# EAGLE design usb-pd (EAGLE 7.7.0)
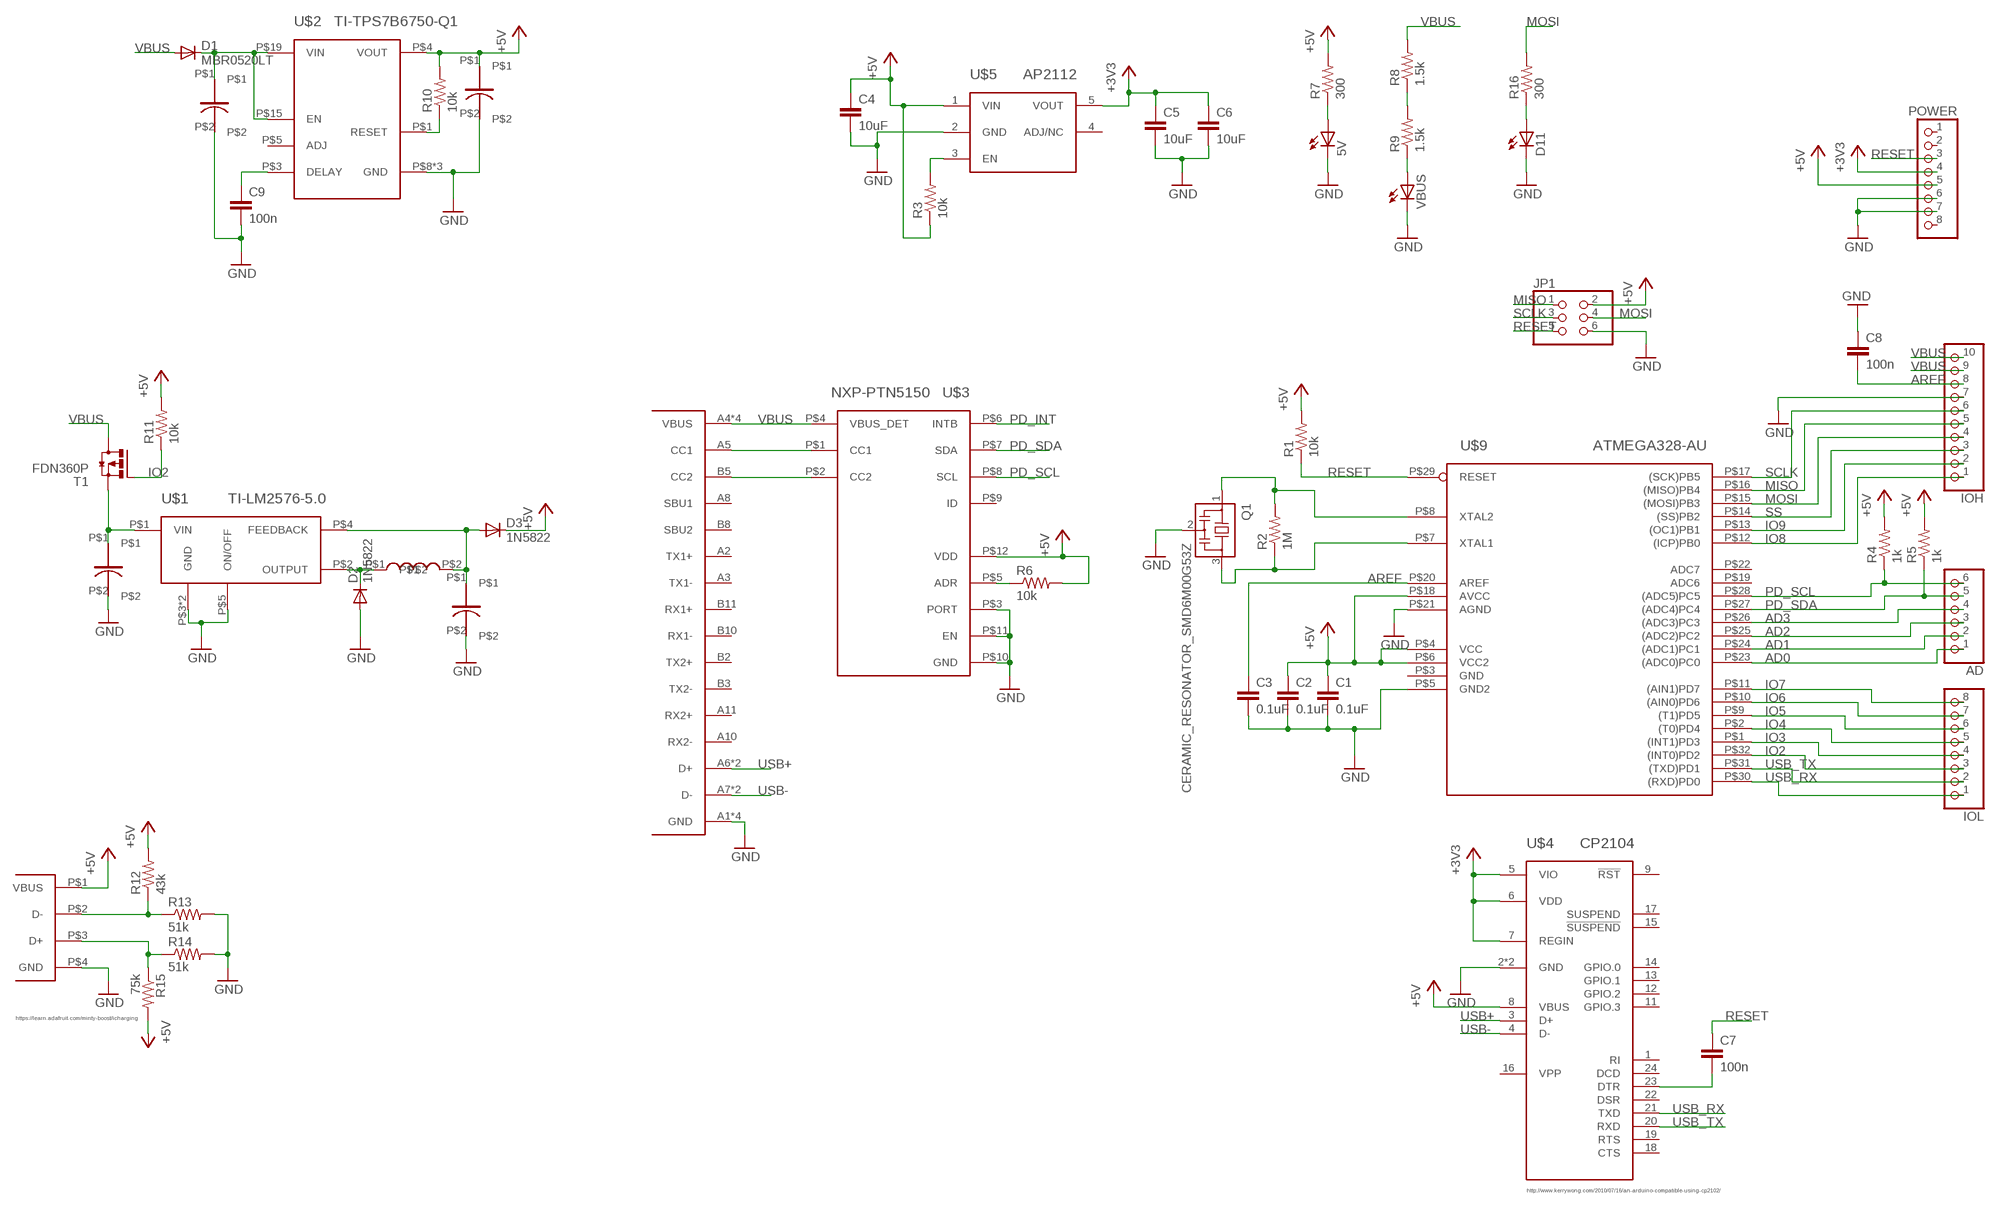
[diagram p0: schematic, sheet 1]

## Parts
5V  LEDCHIPLED_0603  [CHIPLED_0603]
AD  PINHD-1X6  [1X06]
C1  0.1uF  C-EUC0402  [C0402]
C2  0.1uF  C-EUC0402  [C0402]
C3  0.1uF  C-EUC0402  [C0402]
C4  10uF  C-EUC0805  [C0805]
C5  10uF  C-EUC0805  [C0805]
C6  10uF  C-EUC0805  [C0805]
C7  100n  C-EUC0402  [C0402]
C8  100n  C-EUC0402  [C0402]
C9  100n  C-EUC0603  [C0603]
C10  UWT1V101MCL1GS  [UWT1V101MCL1GS]
C11  AVE108M10G24T-F  [AVE108M10G]
C12  WURTH-865080543009-47uF  WURTH-865080543009  [WURTH-865090543005]
C13  WURTH-865090543005-22uF  WURTH-865090543005  [WURTH-865090543005]
D1  MBR0520LT  [SOD123]
D2  1N5822  1N5400  [DO201-15]
D3  1N5822  1N5400  [DO201-15]
D11  LEDCHIPLED_0603  [CHIPLED_0603]
IOH  PINHD-1X10  [1X10]
IOL  PINHD-1X8  [1X08]
J$1  TYPE-C-12401548E4  [AMPHENOL-TYPE-C-12401548E4]
J$2  UE27AC54100  [UE27AC54100]
JP1  PINHD-2X3  [2X03]
POWER  PINHD-1X8  [1X08]
Q1  CERAMIC_RESONATOR_SMD6M00G53Z  [CERAMIC_RESONATOR_SMD]
R1  10k  R-US_R0402  [R0402]
R2  1M  R-US_R0402  [R0402]
R3  10k  R-US_R0402  [R0402]
R4  1k  R-US_R0402  [R0402]
R5  1k  R-US_R0402  [R0402]
R6  10k  R-US_R0402  [R0402]
R7  300  R-US_R0402  [R0402]
R8  1.5k  R-US_R0402  [R0402]
R9  1.5k  R-US_R0402  [R0402]
R10  10k  R-US_R0805  [R0805]
R11  10k  R-US_R0402  [R0402]
R12  43k  R-US_R0402  [R0402]
R13  51k  R-US_R0402  [R0402]
R14  51k  R-US_R0402  [R0402]
R15  75k  R-US_R0402  [R0402]
R16  300  R-US_R0402  [R0402]
T1  FDN360P  [SUPER-SOT3]
U$1  TI-LM2576-5.0  [TO-263]
U$2  TI-TPS7B6750-Q1  [HTSSOP-20]
U$3  NXP-PTN5150  [X2QFN12]
U$4  CP2104  [QFN24_4X4]
U$5  AP2112  [SOT23-5L]
U$7  WEURTH-784771101  [1260]
U$9  ATMEGA328-AU  [32-TQFP]
VBUS  LEDCHIPLED_0603  [CHIPLED_0603]

## Nets
+3V3: C5.1 C6.1 POWER.4 U$4.5(VIO) U$4.6(VDD) U$4.7(REGIN) U$5.5(VOUT)
+5V: C1.1 C2.1 C4.1 C13.P$1 D3.C J$2.P$1(VBUS) JP1.2 POWER.5 R1.2 R3.1 R4.2 R5.2 R6.2 R7.2 R10.2 R11.2 R12.2 R15.2 U$2.P$4(VOUT) U$3.P$12(VDD) U$4.8(VBUS) U$5.1(VIN) U$9.P$4(VCC) U$9.P$6(VCC2) U$9.P$18(AVCC)
AD0: AD.1 U$9.P$23((ADC0)PC0)
AD1: AD.2 U$9.P$24((ADC1)PC1)
AD2: AD.3 U$9.P$25((ADC2)PC2)
AD3: AD.4 U$9.P$26((ADC3)PC3)
AREF: C3.1 C8.2 IOH.8 U$9.P$20(AREF)
GND: 5V.C C1.2 C2.2 C3.2 C4.2 C5.2 C6.2 C8.1 C9.2 C10.P$2 C11.P$2 C12.P$2 C13.P$2 D2.A D11.C IOH.7 J$1.A1(GND) J$1.A12(GND) J$1.B1(GND) J$1.B12(GND) J$2.P$4(GND) JP1.6 POWER.6 POWER.7 Q1.2 R13.2 R14.2 U$1.P$3(GND) U$1.P$5(ON/OFF) U$1.P$6(GND) U$2.P$8(GND) U$2.P$13(GND) U$2.P$21(GND) U$3.P$3(PORT) U$3.P$10(GND) U$3.P$11(EN) U$4.2(GND) U$4.25(GND) U$5.2(GND) U$9.P$5(GND2) U$9.P$21(AGND) VBUS.C
IO2: IOL.3 R11.1 T1.1(G) U$9.P$32((INT0)PD2)
IO3: IOL.4 U$9.P$1((INT1)PD3)
IO4: IOL.5 U$9.P$2((T0)PD4)
IO5: IOL.6 U$9.P$9((T1)PD5)
IO6: IOL.7 U$9.P$10((AIN0)PD6)
IO7: IOL.8 U$9.P$11((AIN1)PD7)
IO8: IOH.1 U$9.P$12((ICP)PB0)
IO9: IOH.2 U$9.P$13((OC1)PB1)
MISO: IOH.5 JP1.1 U$9.P$16((MISO)PB4)
MOSI: IOH.4 JP1.4 R16.2 U$9.P$15((MOSI)PB3)
N$1: C10.P$1 T1.2(S) U$1.P$1(VIN)
N$2: Q1.3 R2.1 U$9.P$7(XTAL1)
N$3: Q1.1 R2.2 U$9.P$8(XTAL2)
N$4: C7.2 U$4.23(DTR)
N$5: J$1.A5(CC1) U$3.P$1(CC1)
N$6: J$1.B5(CC2) U$3.P$2(CC2)
N$7: R3.2 U$5.3(EN)
N$8: R6.1 U$3.P$5(ADR)
N$9: D2.C U$1.P$2(OUTPUT) U$7.P$1
N$10: 5V.A R7.1
N$11: R9.1 VBUS.A
N$12: R8.1 R9.2
N$13: R10.1 U$2.P$1(RESET)
N$14: C9.1 U$2.P$3(DELAY)
N$15: C11.P$1 D3.A U$1.P$4(FEEDBACK) U$7.P$2
N$16: D11.A R16.1
N$17: J$2.P$2(D-) R12.1 R13.1
N$18: J$2.P$3(D+) R14.1 R15.1
N$40: C12.P$1 D1.C U$2.P$15(EN) U$2.P$19(VIN)
PD_INT: U$3.P$6(INTB)
PD_SCL: AD.6 R4.1 U$3.P$8(SCL) U$9.P$28((ADC5)PC5)
PD_SDA: AD.5 R5.1 U$3.P$7(SDA) U$9.P$27((ADC4)PC4)
RESET: C7.1 JP1.5 POWER.3 R1.1 U$9.P$29(RESET)
SCLK: IOH.6 JP1.3 U$9.P$17((SCK)PB5)
SS: IOH.3 U$9.P$14((SS)PB2)
USB+: J$1.A6(D+) J$1.B6(D+) U$4.3(D+)
USB-: J$1.A7(D-) J$1.B7(D-) U$4.4(D-)
USB_RX: IOL.1 U$4.21(TXD) U$9.P$30((RXD)PD0)
USB_TX: IOL.2 U$4.20(RXD) U$9.P$31((TXD)PD1)
VBUS: D1.A IOH.9 IOH.10 J$1.A4(VBUS) J$1.A9(VBUS) J$1.B4(VBUS) J$1.B9(VBUS) R8.2 T1.3(D) U$3.P$4(VBUS_DET)
Unconnected: J$1.A2(TX1+) J$1.A3(TX1-) J$1.A8(SBU1) J$1.A10(RX2-) J$1.A11(RX2+) J$1.B2(TX2+) J$1.B3(TX2-) J$1.B8(SBU2) J$1.B10(RX1-) J$1.B11(RX1+) POWER.1 POWER.2 POWER.8 U$2.P$5(ADJ) U$3.P$9(ID) U$4.1(RI) U$4.9(!RST) U$4.11(GPIO.3) U$4.12(GPIO.2) U$4.13(GPIO.1) U$4.14(GPIO.0) U$4.15(!SUSPEND) U$4.16(VPP) U$4.17(SUSPEND) U$4.18(CTS) U$4.19(RTS) U$4.22(DSR) U$4.24(DCD) U$5.4(ADJ/NC) U$9.P$3(GND) U$9.P$19(ADC6) U$9.P$22(ADC7)

## Notes on the sheet
- https://learn.adafruit.com/minty-boost/icharging
- http://www.kerrywong.com/2010/07/16/an-arduino-compatible-using-cp2102/

## Library data of the parts
5V D11 VBUS = led:LED: LED OSRAM: - CHIPLED LG R971, LG N971, LY N971, LG Q971, LY Q971, LO R971, LY R971 LH N974, LH R974 LS Q976, LO Q976, LY Q976 LO Q996 - Hyper CHIPLED LW Q18S LB Q993, LB Q99A, LB R99A - SideLED LS A670, LO A670, LY A670, LG A670, LP A670 LB A673, LV A673, LT A673, LW A673 LH A674 LY A675 LS A676, LA A676, LO A676, LY A676, LW A676 LS A679, LY A679, LG A679 - Hyper Micro SIDELED® LS Y876, LA Y876, LO Y876, LY Y876 LT Y87S - SmartLED LW L88C, LW L88S LB L89C, LB L89S, LG L890 LS L89K, LO L89K, LY L89K LS L896, LA L896, LO L896, LY L896 - TOPLED LS T670, LO T670, LY T670, LG T670, LP T670 LSG T670, LSP T670, LSY T670, LOP T670, LYG T670 LG T671, LOG T671, LSG T671 LB T673, LV T673, LT T673, LW T673 LH T674 LS T676, LA T676, LO T676, LY T676, LB T676, LH T676, LSB T676, LW T676 LB T67C, LV T67C, LT T67C, LS T67K, LO T67K, LY T67K, LW E67C LS E67B, LA E67B, LO E67B, LY E67B, LB E67C, LV E67C, LT E67C LW T67C LS T679, LY T679, LG T679 LS T770, LO T770, LY T770, LG T770, LP T770 LB T773, LV T773, LT T773, LW T773 LH T774 LS E675, LA E675, LY E675, LS T675 LS T776, LA T776, LO T776, LY T776, LB T776 LHGB T686 LT T68C, LB T68C - Hyper Mini TOPLED® LB M676 - Mini TOPLED Santana® LG M470 LS M47K, LO M47K, LY M47K Source: http://www.osram.convergy.de LUXEON: - LUMILED® LXK2-PW12-R00, LXK2-PW12-S00, LXK2-PW14-U00, LXK2-PW14-V00 LXK2-PM12-R00, LXK2-PM12-S00, LXK2-PM14-U00 LXK2-PE12-Q00, LXK2-PE12-R00, LXK2-PE12-S00, LXK2-PE14-T00, LXK2-PE14-U00 LXK2-PB12-K00, LXK2-PB12-L00, LXK2-PB12-M00, LXK2-PB14-N00, LXK2-PB14-P00, LXK2-PB14-Q00 LXK2-PR12-L00, LXK2-PR12-M00, LXK2-PR14-Q00, LXK2-PR14-R00 LXK2-PD12-Q00, LXK2-PD12-R00, LXK2-PD12-S00 LXK2-PH12-R00, LXK2-PH12-S00 LXK2-PL12-P00, LXK2-PL12-Q00, LXK2-PL12-R00 Source: www.luxeon.com KINGBRIGHT: KA-3528ASYC Source: www.kingbright.com
AD = pinhead:PINHD-1X6: PIN HEADER
C1-C9 = rcl:C-EU: CAPACITOR, European symbol
C10 = usb-pd:UWT1V101MCL1GS
C11 = usb-pd:AVE108M10G24T-F
C12 = usb-pd:WURTH-865080543009
C13 = usb-pd:WURTH-865090543005
D1 = diode:MBR0520LT: SCHOTTKY BARRIER RECTIFIER Source: http://onsemi.com .. MBR0520LT1-D.pdf
D2 D3 = diode:1N5400: DIODE standard rectifier, 3 A, 50 V (Motorola)
IOH = pinhead:PINHD-1X10: PIN HEADER
IOL POWER = pinhead:PINHD-1X8: PIN HEADER
J$1 = usb-pd:TYPE-C-12401548E4
J$2 = usb-pd:UE27AC54100
JP1 = pinhead:PINHD-2X3: PIN HEADER
Q1 = usb-pd:CERAMIC_RESONATOR_SMD: Resonator Source: murata.co.jp; MPN: CSTCR6M00G53-R0; OC_FARNELL: 1170434; OC_NEWARK: 25M8759
R1-R16 = rcl:R-US_: RESISTOR, American symbol
T1 = transistor-power:FDN360P: Single P-Channel, PowerTrench (R) MOSFET Source: http://www.fairchildsemi.com/ds/FD/FDN360P.pdf
U$1 = usb-pd:TI-LM2576-5.0
U$2 = usb-pd:TI-TPS7B6750-Q1
U$3 = usb-pd:NXP-PTN5150
U$4 = usb-pd:CP2104
U$5 = usb-pd:AP2112
U$7 = usb-pd:WEURTH-784771101
U$9 = usb-pd:ATMEGA328-AU; DIGIKEY: ATMEGA328-AU-ND

## Board
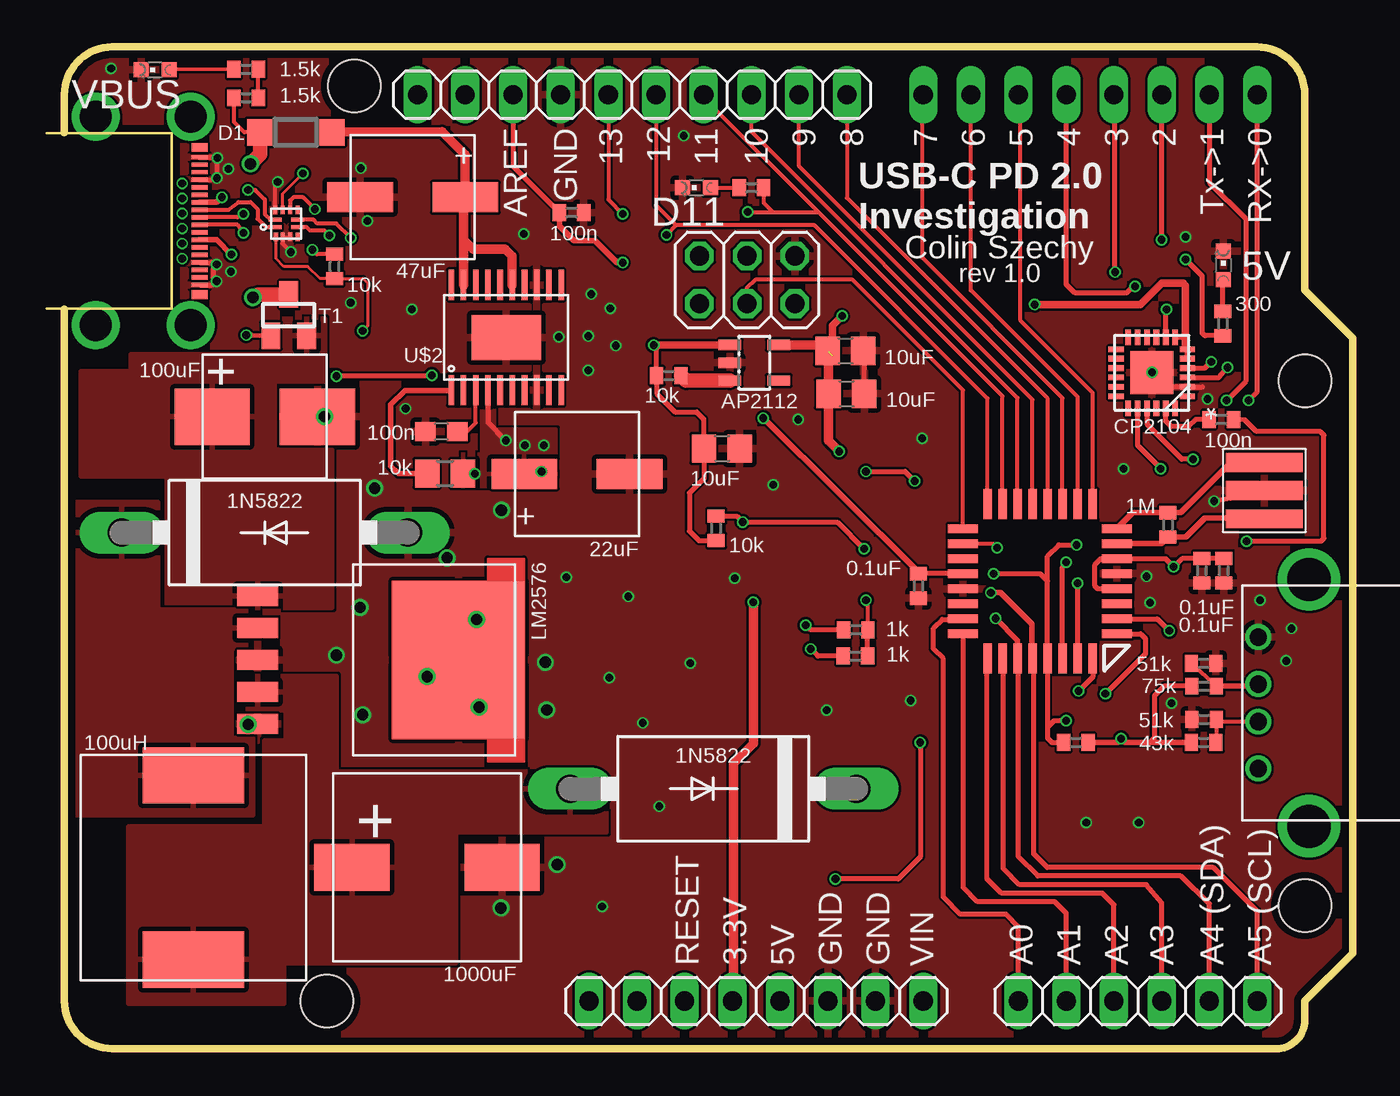
[diagram p1: board, top side]
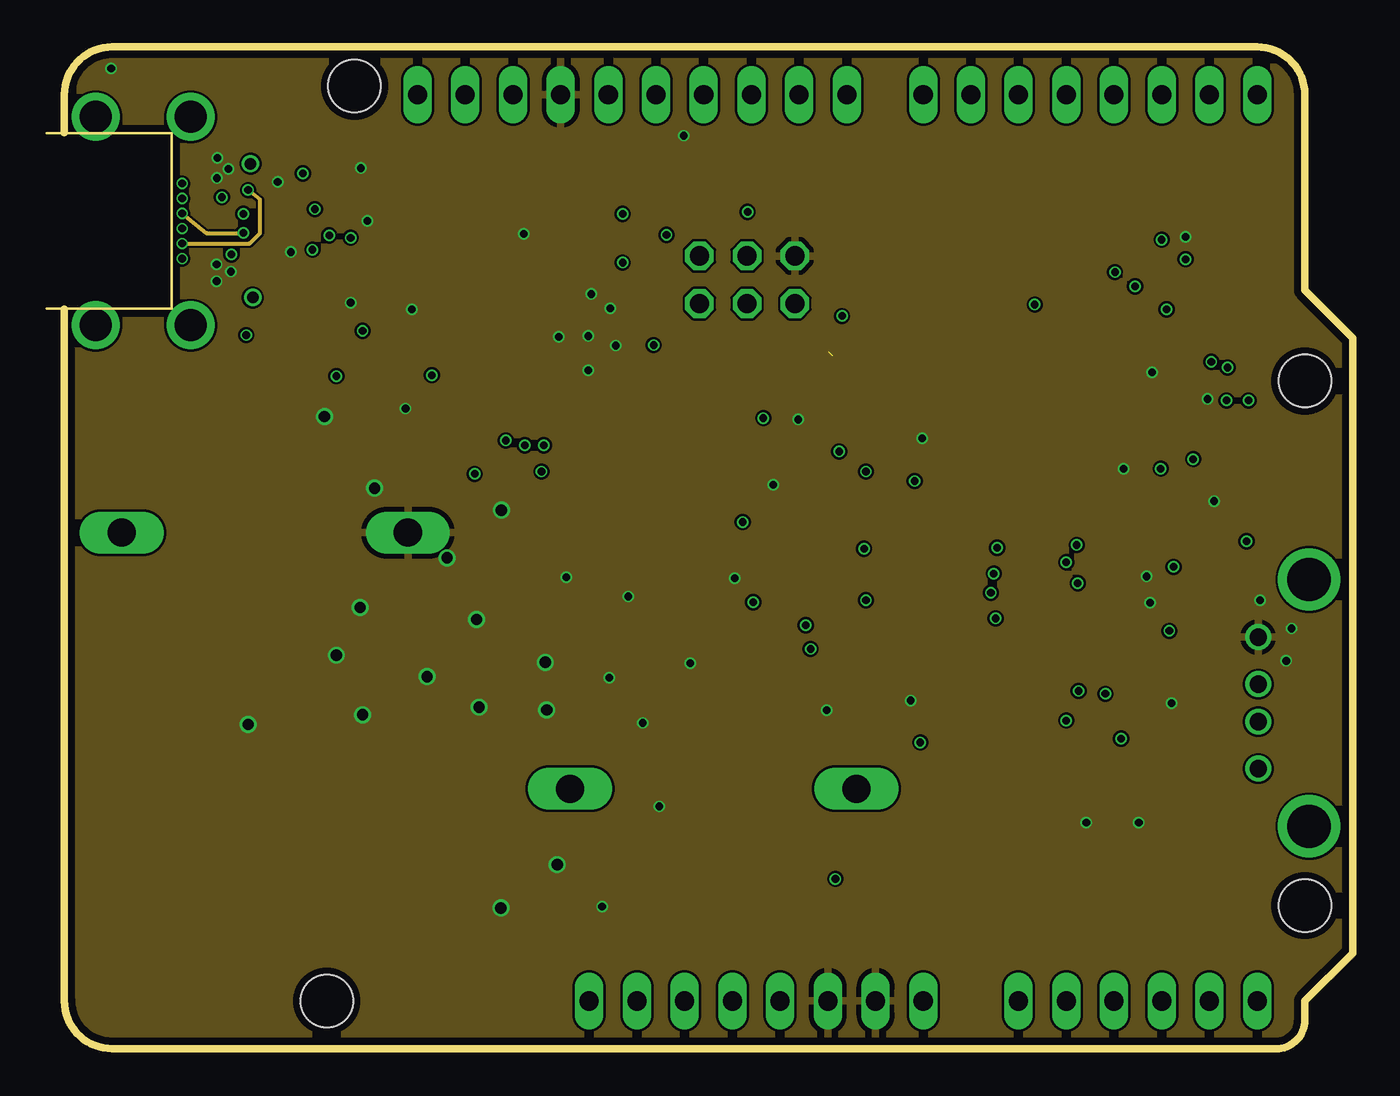
[diagram p2: board, inner layer Route2]
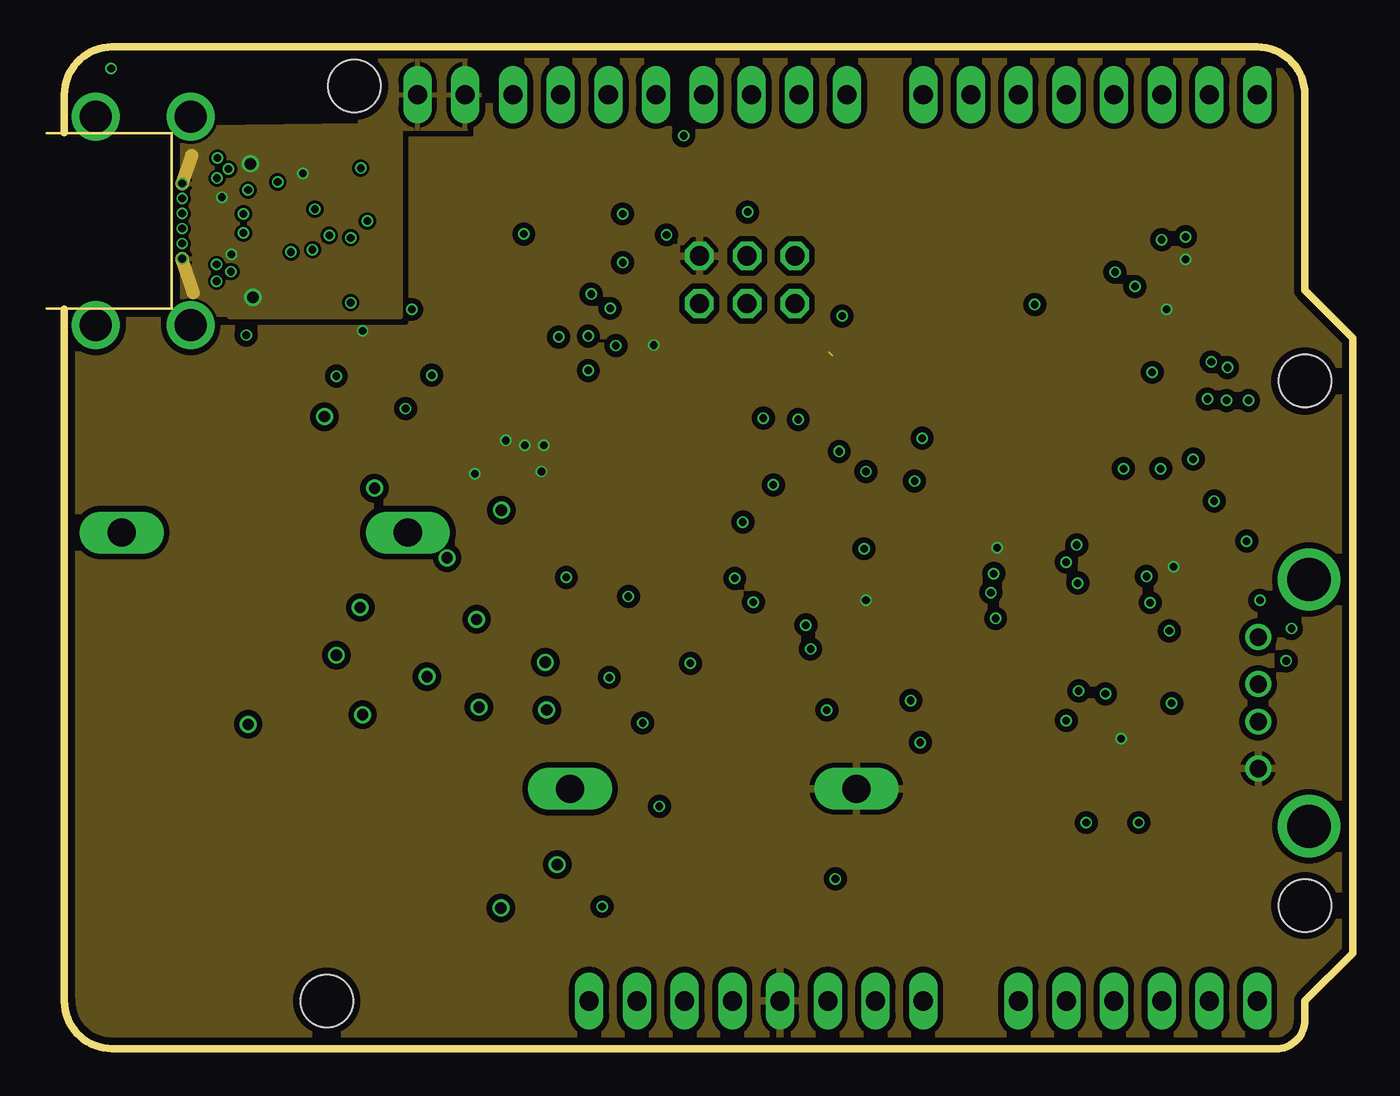
[diagram p3: board, inner layer Route15]
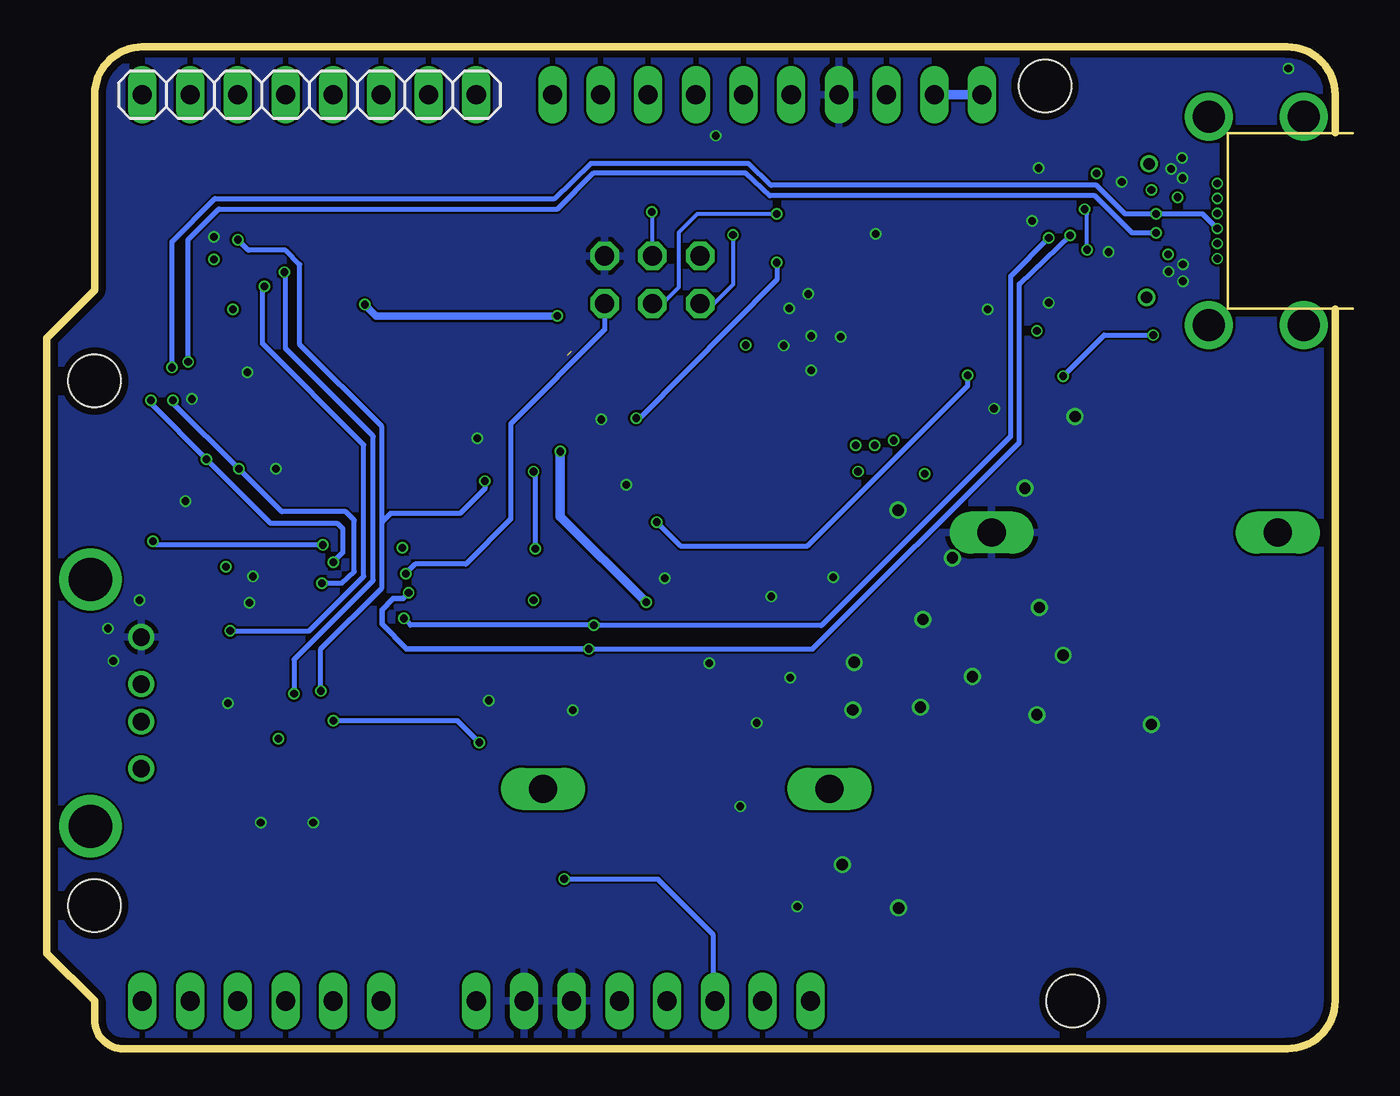
[diagram p4: board, bottom side, seen from below]

Size 69.51 x 53.34 mm. Coordinates in mm from the lower left corner, seen from the top.
Outline: 0.93,39.37 0.93,2.54 arc90 3.47,0 65.45,0 arc90 66.97,1.52 66.97,2.54 69.51,5.08 69.51,37.85 66.97,40.39 66.97,50.8 arc90 64.43,53.34 3.47,53.34 arc90 0.93,50.8 0.93,48.77
Copper layers (1*2*15*16): Top 0.035559375mm / dielectric 0.17018125mm / Route2 0.01778125mm / dielectric 47mil / Route15 0.01778125mm / dielectric 0.17018125mm / Bottom 0.035559375mm
Design rules "OSHPark-4layer": minimum track width 5mil, minimum drill 10mil, track to track 5mil, track to pad 5mil, pad to pad 5mil, via to via 5mil, smd to smd 5mil, copper to edge 15mil, drill to drill 6mil, minimum pad ring 4mil, minimum via ring 4mil, stop-mask expansion 2.5mil, vias tented up to drill 0mil, thermal gap 10mil
Holes 2.8 mm at 66.97,35.56 66.97,7.62 14.9,2.54 16.37,51.26

### Footprints (pad centres in the part's own frame; a part is rotated, then mirrored left to right if it is on the bottom)
CHIPLED_0603 = smd 0.8 x 0.8: A 0,-0.75; C 0,0.75
1X06 = drill 1.016 long: 1 -6.35,0; 2 -3.81,0; 3 -1.27,0; 4 1.27,0; 5 3.81,0; 6 6.35,0
C0402 = smd 0.7 x 0.9: 1 -0.65,0; 2 0.65,0
C0805 = smd 1.3 x 1.5: 1 -0.95,0; 2 0.95,0
C0603 = smd 1.1 x 1: 1 -0.85,0; 2 0.85,0
UWT1V101MCL1GS = smd 3 x 4: P$1 0,2.8; P$2 0,-2.8
AVE108M10G = smd 4 x 2.5: P$1 -4,0; P$2 4,0
WURTH-865090543005 = smd 3.5 x 1.6: P$1 2.8,0; P$2 -2.8,0
SOD123 = smd 1.4 x 1.4: A 1.9,0; C -1.9,0
DO201-15 = drill 1.499 long: A 7.62,0; C -7.62,0
1X10 = drill 1.016 long: 1 -11.43,0; 2 -8.89,0; 3 -6.35,0; 4 -3.81,0; 5 -1.27,0; 6 1.27,0; 7 3.81,0; 8 6.35,0; 9 8.89,0; 10 11.43,0
1X08 = drill 1.016 long: 1 -8.89,0; 2 -6.35,0; 3 -3.81,0; 4 -1.27,0; 5 1.27,0; 6 3.81,0; 7 6.35,0; 8 8.89,0
AMPHENOL-TYPE-C-12401548E4 = smd 0.23 x 0.85: A1 -2.2,-0.425; A2 -1.8,-0.425; A3 -1.4,-0.425; A4 -1,-0.425; A5 -0.6,-0.425; A6 -0.2,-0.425; A7 0.2,-0.425; A8 0.6,-0.425; A9 1,-0.425; A10 1.4,-0.425; A11 1.8,-0.425; A12 2.2,-0.425; B1 3.4,-0.425; B2 3,-0.425; B3 2.6,-0.425; B10 -2.6,-0.425; B11 -3,-0.425; B12 -3.4,-0.425 | drill 0.4 pad 0.6: B4 2,-1.35; B5 1.2,-1.35; B6 0.4,-1.35; B7 -0.4,-1.35; B8 -1.2,-1.35; B9 -2,-1.35 | smd 0.46 x 0.85: P$1 -3.915,-0.425; P$2 3.915,-0.425 | drill 1.7: P$3 -5.55,-0.9; P$4 -5.55,-5.95; P$5 5.55,-0.9; P$6 5.55,-5.95
UE27AC54100 = drill 0.92: P$1 -3.5,2.71; P$2 -1,2.71; P$3 1,2.71; P$4 3.5,2.71 | drill 2.3: P$7 -6.57,0; P$8 6.57,0
2X03 = drill 1.016 octagon: 1 -2.54,-1.27; 2 -2.54,1.27; 3 0,-1.27; 4 0,1.27; 5 2.54,-1.27; 6 2.54,1.27
CERAMIC_RESONATOR_SMD = smd 1 x 4.1: 1 -1.5,0; 2 0,0; 3 1.5,0
R0402 = smd 0.7 x 0.9: 1 -0.65,0; 2 0.65,0
R0805 = smd 1.3 x 1.5: 1 -0.95,0; 2 0.95,0
SUPER-SOT3 = smd 1 x 1.4: 1 -0.95,-1.1; 2 0.95,-1.1; 3 0,1.1
TO-263 = smd 2.159 x 1.067: P$1 0,-3.404; P$2 0,-1.702; P$3 0,0; P$4 0,1.702; P$5 0,3.404 | smd 6.985 x 8.331: P$6 -10.693,0
HTSSOP-20 = smd 0.3 x 1.6: P$1 -2.925,-2.8; P$2 -2.275,-2.8; P$3 -1.625,-2.8; P$4 -0.975,-2.8; P$5 -0.325,-2.8; P$6 0.325,-2.8; P$7 0.975,-2.8; P$8 1.625,-2.8; P$9 2.275,-2.8; P$10 2.925,-2.8; P$11 2.925,2.8; P$12 2.275,2.8; P$13 1.625,2.8; P$14 0.975,2.8; P$15 0.325,2.8; P$16 -0.325,2.8; P$17 -0.975,2.8; P$18 -1.625,2.8; P$19 -2.275,2.8; P$20 -2.925,2.8 | smd 3.7 x 2.4: P$21 0,0
X2QFN12 = smd 0.7 x 0.22: P$1 -0.6,-0.2; P$2 -0.6,0.2; P$7 0.6,0.2; P$8 0.6,-0.2 | smd 0.22 x 0.45: P$3 -0.6,0.725; P$4 -0.2,0.725; P$5 0.2,0.725; P$6 0.6,0.725; P$9 0.6,-0.725; P$10 0.2,-0.725; P$11 -0.2,-0.725; P$12 -0.55,-0.725
QFN24_4X4 = smd 0.813 x 0.279: 1 -1.892,1.25; 6 -1.892,-1.25; 13 1.892,-1.25; 18 1.892,1.25 | smd 0.813 x 0.305: 2 -1.892,0.75; 3 -1.892,0.25; 4 -1.892,-0.25; 5 -1.892,-0.75; 14 1.892,-0.75; 15 1.892,-0.25; 16 1.892,0.25; 17 1.892,0.75 | smd 0.279 x 0.813: 7 -1.25,-1.892; 12 1.25,-1.892; 19 1.25,1.892; 24 -1.25,1.892 | smd 0.305 x 0.813: 8 -0.75,-1.892; 9 -0.25,-1.892; 10 0.25,-1.892; 11 0.75,-1.892; 20 0.75,1.892; 21 0.25,1.892; 22 -0.25,1.892; 23 -0.75,1.892 | smd 2.286 x 2.286: 25 0,0
SOT23-5L = smd 0.55 x 1.2: 1 -0.95,-1.3; 2 0,-1.3; 3 0.95,-1.3; 4 0.95,1.3; 5 -0.95,1.3
1260 = smd 5.4 x 3: P$1 0,4.9; P$2 0,-4.9
32-TQFP = smd 1.6 x 0.45: P$1 -4.1,2.8; P$2 -4.1,2; P$3 -4.1,1.2; P$4 -4.1,0.4; P$5 -4.1,-0.4; P$6 -4.1,-1.2; P$7 -4.1,-2; P$8 -4.1,-2.8; P$17 4.1,-2.8; P$18 4.1,-2; P$19 4.1,-1.2; P$20 4.1,-0.4; P$21 4.1,0.4; P$22 4.1,1.2; P$23 4.1,2; P$24 4.1,2.8 | smd 0.45 x 1.6: P$9 -2.8,-4.1; P$10 -2,-4.1; P$11 -1.2,-4.1; P$12 -0.4,-4.1; P$13 0.4,-4.1; P$14 1.2,-4.1; P$15 2,-4.1; P$16 2.8,-4.1; P$25 2.8,4.1; P$26 2,4.1; P$27 1.2,4.1; P$28 0.4,4.1; P$29 -0.4,4.1; P$30 -1.2,4.1; P$31 -2,4.1; P$32 -2.8,4.1

### Placement (x,y rotation side)
5V  62.63,41.71 0 top
AD  58.08,2.54 0 top
C1  61.48,25.45 270 top
C2  62.65,25.45 270 top
C3  46.4,24.64 270 top
C4  35.93,31.95 0 top
C5  42.51,37.16 0 top
C6  42.56,34.87 0 top
C7  62.52,33.5 180 top
C8  27.93,44.53 180 top
C9  21,32.87 180 top
C10  11.6,33.66 90 top
C11  20.23,9.65 0 top
C12  19.47,45.34 0 top
C13  28.21,30.61 180 top
D1  13.25,48.79 180 top
D2  11.6,27.48 0 top
D3  35.47,13.84 180 top
D11  34.59,45.85 90 top
IOH  31.16,50.8 180 top
IOL  55.54,50.8 0 bottom
J$1  8.55,44.07 270 top
J$2  67.2,18.41 90 top
JP1  37.28,40.94 0 top
POWER  37.76,2.54 0 top
Q1  64.81,29.72 270 top
R1  54.78,16.31 0 top
R2  59.68,27.89 90 top
R3  33.11,35.84 0 top
R4  43.04,20.9 0 top
R5  43.07,22.3 0 top
R6  15.31,41.66 270 top
R7  62.6,38.61 270 top
R8  10.61,50.62 180 top
R9  10.61,52.15 0 top
R10  21.2,30.63 0 top
R11  35.63,27.71 270 top
R12  61.59,16.31 180 top
R13  61.61,17.53 180 top
R14  61.59,20.52 0 top
R15  61.61,19.3 180 top
R16  37.51,45.85 0 top
T1  12.87,39.07 0 top
U$1  11.22,20.7 180 top
U$2  24.45,37.87 0 top
U$3  12.74,43.94 0 top
U$4  58.82,35.99 180 top
U$5  37.66,36.53 270 top
U$7  7.79,9.65 0 top
U$9  52.87,24.89 180 top
VBUS  5.76,52.12 90 top

### Tracks (layer width: path | path; a pad name or v marks a point on that pad's centre or on a via)
+3V3  (via drill 0.41)  (1 unrouted)
  Top 0.305: U$4.6 U$4.5 | U$4.7 60.53,37.88
  Top 0.406: 41.81,36.91 41.81,38.5 v42.33,39.01 | v52.59,39.62 58.21,39.62 59.35,40.77 60.49,40.77 60.62,40.64 60.62,37.8 | 60.62,37.8 60.62,37.33 U$4.6 | 60.53,37.88 60.62,37.8
  Top 0.508: U$5.5 41.24,37.48 C5.1 41.61,37.11 C6.1 41.61,32.37 v42.18,31.8 | v37.61,23.77 37.61,16.26 36.54,15.19 36.54,2.59 POWER.4
  Bottom 0.406: v42.33,39.01 51.98,39.01 v52.59,39.62
  Bottom 0.508: v42.18,31.8 42.18,28.35 v37.61,23.77
+5V  (via drill 0.41)
  Top 0.152: v16.8,38.23 17.06,38.48 17.06,40.77 16.82,41.01 R6.2 14.53,41.01 13.88,41.66 12.61,41.66 12.19,42.08 U$3.P$12
  Top 0.203: R5.2 43.72,23.76 v43.6,23.88 | U$9.P$18 50.37,26.89 v50.59,26.67
  Top 0.254: C2.1 C1.1 60.43,26.1 v59.98,25.65 59.55,26.09 U$9.P$6 56.1,26.09 55.79,25.78 55.79,24.64 55.94,24.49 U$9.P$4 | R15.2 59.48,19.3 58.97,18.8 58.97,16.56 58.71,16.31 | v32.3,37.47 32.46,37.3 R3.1 32.46,34.89 33.44,33.91 34.59,33.91 34.97,33.53 34.97,31.97 C4.1 34.98,30.37 34.2,29.59 34.2,27.56 34.71,27.05 35.62,27.05 R11.2 | U$4.8 59.57,39.33 v59.6,39.37 | R7.2 61.65,37.96 61.51,38.1 61.51,41.15 v60.62,42.04 | R4.2 43.69,22.28 R5.2
  Top 0.305: R1.2 56.99,16.31 v57.19,16.51 57.39,16.31 58.71,16.31 R12.2 | U$2.P$4 23.48,33.34 v24.43,32.38
  Top 0.406: U$5.1 v32.31,37.48 v32.3,37.47
  other vias: 26.46,32.13 26.33,30.73 22.77,30.61 25.44,32.13
  pour Top: 23.13,34.09 23.13,31.65 21.71,31.65 21.71,29.97 27.09,29.97 27.09,32.97 23.84,32.97 23.84,34.09
  pour Route15 (isolate 0.305, rank 6): 0.55,54.74 71.54,54.74 71.54,-1.65 0.55,-1.65
AD0
  Top 0.254: AD.1 51.73,6.5 51.07,7.16 48.63,7.16 47.72,8.08 47.72,20.78 47.21,21.29 47.21,22.4 47.67,22.86 48.74,22.86 U$9.P$23
AD1
  Top 0.254: AD.2 54.27,7.21 53.66,7.82 49.55,7.82 48.78,8.59 48.78,22.08 U$9.P$24
AD2
  Top 0.254: AD.3 56.81,7.67 56.2,8.28 50.82,8.28 50.05,9.04 50.05,20.77 U$9.P$25 50.1,20.76
AD3
  Top 0.254: AD.4 59.35,7.77 58.54,8.74 51.78,8.74 50.92,9.6 50.92,20.75 U$9.P$26
AREF  (via drill 0.41)
  Top 0.254: IOH.8 24.81,47 C8.2 | U$9.P$20 C3.1
  Top 0.305: C3.1 46.4,25.4 v38.14,33.58 | v30.65,41.86 30.34,41.86 29.18,43.03 28.06,43.03 27.29,43.79 27.29,44.51 C8.2
  Bottom 0.254: v30.65,41.86 30.65,40.95 37.94,33.58 v38.14,33.58
GND  (via drill 0.41, 0.6)
  Top 0.203: 16.13,44.8 C12.P$2 | U$3.P$3 12.14,46.01 v12.28,46.15 | U$3.P$10 U$3.P$11 12.54,42.87 v13,42.42
  Top 0.254: C6.2 43.51,37.11 C5.2 | 59.57,36.74 v58.84,36.02 U$4.25 59.57,35.24 U$4.2 61.52,35.24 61.53,35.26 | Q1.2 65.85,29.72 v62.14,29.16 | J$1.A1 8.72,46.27 v9.06,46.35 9.06,47.32 8.78,47.47 J$1.B12 | J$1.B1 8.81,40.67 8.88,40.74 8.88,41.75 8.76,41.87 J$1.A12
  other vias: 10.71,17.27 24.17,7.49 20.23,19.81 15.41,20.95 16.68,23.5 16.8,17.78 14.77,33.66 3.42,52.2 19.09,34.09 58.13,12.04 58.54,25.15 60.62,43.23 61.79,34.59 9.08,47.42 16.7,46.89 16.17,39.73 17.06,44.07 57.32,30.89 27.65,25.1 23,18.19 36.62,25.04 28.82,36.12 27.24,37.9 28.97,40.18 19.42,39.37 41.52,18.03 45.99,18.54 46.6,32.51 58.74,23.75 55.34,12.04 66.26,22.38 65.98,20.65 64.58,23.88 38.67,30.02 40,33.5 25.39,43.38 28.82,37.95 29.99,39.42 30.29,37.44 21.3,26.14 17.44,29.84 24.2,28.68 26.61,18.03 22.88,22.86 26.53,20.57 27.17,9.8 33.9,48.62 9.03,41.76 59.88,18.39 9.79,41.38 9.03,40.87 9.67,46.84 30.95,24.08 34.25,20.52 29.94,19.76 29.56,7.57 31.71,17.35 32.6,12.9
  pour Top (rank 6): 0.55,54.61 71.54,54.61 71.54,-1.4 0.55,-1.4
  pour Bottom: 0.55,54.86 71.54,54.86 71.54,-1.65 0.55,-1.65
  pour Route2: 0.55,54.74 71.54,54.74 71.54,-1.65 0.55,-1.65
IO2  (via drill 0.41)
  Top 0.254: U$9.P$32 55.67,19.79 v54.93,19.05 | v59.35,43.08 IOL.3 | R11.1 36.73,28.36 v37.05,28.04 42.08,28.04 v43.5,26.62 | v10.61,38 10.88,38 T1.1 | v43.6,30.73 45.69,30.73 v46.19,30.23 | v20.49,35.87 20.44,35.81 v15.41,35.81
  Bottom 0.254: v54.93,19.05 54.93,21.29 51.68,24.54 51.68,28.04 | v59.35,43.08 58.79,42.52 56.81,42.52 56.05,41.76 56.05,37.49 51.68,33.12 51.68,28.04 | v37.05,28.04 35.78,26.77 29.02,26.77 20.49,35.31 v20.49,35.87 | v15.41,35.81 13.22,38 v10.61,38 | v43.5,26.62 43.5,30.63 v43.6,30.73 | v46.19,30.23 46.19,29.82 47.51,28.5 51.22,28.5 51.68,28.04
IO3  (via drill 0.41)
  Top 0.254: U$9.P$1 58.24,22.09 58.49,21.84 58.49,21.03 v56.35,18.9 | v56.86,41.35 56.86,50.75 IOL.4
  Bottom 0.254: v56.86,41.35 56.81,41.3 56.81,37.29 52.14,32.61 52.14,24.94 56.35,20.73 v56.35,18.9
IO4  (via drill 0.41)
  Top 0.254: U$9.P$2 59.12,22.89 v59.76,22.25 | v57.93,40.59 57.83,40.59 57.47,40.23 54.73,40.23 54.27,40.69 IOL.5
  Bottom 0.254: v59.76,22.25 55.54,22.25 52.64,25.15 52.64,32.16 58.03,37.54 58.03,40.49 v57.93,40.59
IO5
  Top 0.203: U$9.P$9 55.67,34.92 51.83,38.76 51.83,50.7 IOL.6
IO6
  Top 0.203: U$9.P$10 54.87,34.7 49.19,40.39 IOL.7
IO7
  Top 0.203: U$9.P$11 54.07,34.64 46.6,42.11 46.6,50.75 IOL.8
IO8
  Top 0.203: IOH.1 42.59,45.31 53.25,34.65 53.25,29.01 U$9.P$12
IO9
  Top 0.203: U$9.P$13 52.47,34.56 40.05,46.99 IOH.2 40.1,50.75
MISO  (via drill 0.41)
  Top 0.203: U$9.P$16 50.07,34.63 40.86,43.84 33.49,43.84 | 33.49,43.84 v32.98,43.33 | IOH.5 32.43,44.91 33.49,43.84
  Bottom 0.203: v32.98,43.33 32.98,40.69 34.05,39.62 34.69,39.62 JP1.1
MOSI  (via drill 0.41)
  Top 0.203: U$9.P$15 50.87,34.74 41.06,44.55 | 41.06,44.55 34.97,50.65 IOH.4 | v37.3,44.55 38.65,44.55 | 38.65,44.55 41.06,44.55 | R16.2 38.16,45.05 38.65,44.55
  Bottom 0.203: JP1.4 37.28,44.53 v37.3,44.55
N$1
  pour Top (rank 2): 6.39,23.5 15.15,23.5 15.15,31.88 12.11,31.88 12.11,35.56 14.77,35.56 14.77,38.86 11.85,38.86 11.85,36.96 4.49,36.96 4.49,36.07 1.82,36.07 1.82,30.48 6.39,30.48
N$2
  Top 0.305: U$9.P$7 59.33,26.89 R2.1 60.63,27.24 61.64,28.25 64.78,28.25 Q1.3
N$3
  Top 0.305: U$9.P$8 57.82,28.54 R2.2 60.36,28.54 63.03,31.22 Q1.1 64.79,31.24
N$4
  Top 0.254: C7.2 61.15,33.5 60.77,33.12 59.86,33.12 59.57,33.41 U$4.23
N$5
  Top 0.203: J$1.A5 9.66,44.67 10.2,45.09 10.84,45.09 11.22,44.7 11.22,44.2 11.67,43.74 U$3.P$1
N$6  (via drill 0.41)
  Top 0.203: U$3.P$2 11.91,44.14 11.6,44.45 11.6,45.21 11.09,45.72 v10.71,45.72
  Route2 0.203: J$1.B5 10.78,42.87 11.34,43.43 11.34,45.21 v10.71,45.72
N$7
  Top 0.762: U$5.3 34.03,35.58 R3.2
N$8  (via drill 0.41)
  Top 0.203: R6.1 14.38,42.31 v14.14,42.55 | v14.27,44.7 13.63,45.34 13.12,45.34 12.94,45.16 U$3.P$5
  Bottom 0.203: v14.14,42.55 14.14,44.45 v14.27,44.7
N$9
  pour Top: 1.57,29.08 1.57,12.45 10.96,12.45 10.96,16.51 9.82,16.51 9.82,21.34 10.58,21.34 10.58,23.37 5.88,23.37 5.88,29.08
N$10
  Top 0.254: R7.1 62.6,40.93 5V.A
N$11
  Top 0.203: R9.1 VBUS.A
N$12
  Top 0.203: R8.1 R9.2
N$13
  Top 0.305: R10.1 18.71,30.63 18.3,31.04 18.3,34.29 19.07,35.05 21.51,35.05 U$2.P$1
N$14
  Top 0.203: U$2.P$3 | C9.1 22.37,32.87 22.82,33.33 U$2.P$3 | U$2.P$3
N$15
  pour Top: 12.61,2.41 4.36,2.41 4.36,11.81 11.6,11.81 11.6,16.38 12.74,16.38 12.74,18.03 10.71,18.03 10.71,19.81 15.41,19.81 15.41,14.73 29.76,14.73 29.76,11.56 21.76,11.56 21.76,4.57 12.61,4.57
N$16
  Top 0.203: D11.A R16.1
N$17
  Top 0.203: R12.1 62.26,16.33 R13.1 62.37,17.41 J$2.P$2
N$18
  Top 0.203: R15.1 R14.1
  Top 0.305: R15.1 64.35,19.3 J$2.P$3
N$40
  Top 0.508: D1.C 21.05,48.82 22.27,47.6 C12.P$1 22.18,45.24 22.18,43.08 | U$2.P$19 22.18,43.08 | U$2.P$15 24.77,42.2 24.4,42.57 22.68,42.57 22.18,43.08
PD_SCL  (via drill 0.41)
  Top 0.203: v15.03,43.31 14.77,43.56 14.01,43.56 13.83,43.74 U$3.P$8
  Top 0.254: AD.6 64.43,7.32 62.09,9.65 53.25,9.65 52.54,10.36 52.54,20.72 U$9.P$28 52.49,20.77 | R4.1 41.04,20.9 v40.66,21.29
  Top 0.305: v50.26,24.28 50.77,24.28 52.44,22.61 52.44,20.82 U$9.P$28
  Bottom 0.254: v40.66,21.29 28.74,21.29 17.75,32.28 17.75,40.72 v15.03,43.31
  Bottom 0.305: v40.66,21.29 50.36,21.29 51.68,22.61 51.68,23.37 51.07,23.98 50.56,23.98 v50.26,24.28
PD_SDA  (via drill 0.41)
  Top 0.203: v16.17,43.18 15.41,43.94 14.39,43.94 14.19,44.14 U$3.P$7
  Top 0.254: AD.5 61.89,7.72 60.37,9.2 52.75,9.2 51.73,10.21 51.73,20.73 U$9.P$27 | R5.1 40.66,22.3 v40.4,22.55
  Top 0.305: U$9.P$27 51.67,21.75 v50.51,22.91
  Bottom 0.254: v50.51,22.91 50.16,22.55 v40.4,22.55 40.38,22.53 28.29,22.53 18.2,32.61 18.2,41.15 v16.17,43.18
RESET  (via drill 0.41)
  Top 0.254: 53.27,17.12 U$9.P$29 53.27,24.89 | 53.27,17.12 53.27,16.54 53.51,16.31 R1.1 | v46.5,16.31 46.5,10.21 45.33,9.04 v41.98,9.04 | C7.1 63.78,33.48 64.39,32.87 67.78,32.87 67.99,32.66 67.99,27.18 67.83,27.03 v63.87,27.03 | 53.27,24.89 53.27,26.23 53.86,26.82 v54.83,26.82 | v50.41,25.3 52.87,25.3 53.27,24.89 | 53.27,17.12 53.63,17.48 v54.27,17.48
  Bottom 0.254: v41.98,9.04 37,9.04 34.05,6.1 34.05,2.64 POWER.3 | JP1.5 39.82,38.28 44.82,33.27 44.82,28.19 47.21,25.81 49.9,25.81 v50.41,25.3 | v54.27,17.48 47.67,17.48 v46.5,16.31 | v54.83,26.82 63.67,26.82 v63.87,27.03
SCLK  (via drill 0.41)
  Top 0.203: U$9.P$17 48.77,35.06 42.89,40.95 37.71,40.95 37.25,40.49 37.25,39.7 JP1.3 | IOH.6 29.89,45.21 v30.65,44.45
  Bottom 0.203: JP1.3 36.74,39.67 35.88,40.54 35.88,43.46 34.89,44.45 v30.65,44.45
SS
  Top 0.203: U$9.P$14 51.67,34.65 37.51,48.82 IOH.3 37.56,50.75
USB+  (via drill 0.41)
  Top 0.203: v10.46,44.45 10.15,44.27 J$1.A6
  Top 0.254: U$4.3 62.4,35.74 v62.85,36.27
  Bottom 0.254: v62.85,36.27 62.85,42.98 60.57,45.26 42.48,45.26 40.55,47.14 32.17,47.14 30.98,46 30.95,45.97 13.63,45.97 12.11,44.45 v10.46,44.45 7.98,44.45 J$1.B6
USB-  (via drill 0.41)
  Top 0.203: v10.46,43.43 10.15,43.87 J$1.A7
  Top 0.254: U$4.4 61.66,36.24 v61.99,36.58
  Route2 0.203: J$1.B7 8.49,43.43 v10.46,43.43
  Bottom 0.254: v61.99,36.58 61.99,43.08 60.37,44.7 42.33,44.7 40.4,46.63 32.32,46.63 31.03,45.41 13.71,45.41 11.73,43.43 v10.46,43.43
USB_RX  (via drill 0.41)
  Top 0.254: U$9.P$30 54.07,25.65 v54.27,25.91 | v61.03,31.39 60.42,31.39 58.59,33.22 58.59,34.08 U$4.21 | v63.97,34.52 64.43,34.98 IOL.1
  Bottom 0.254: v63.97,34.52 63.97,34.34 v61.03,31.39 57.62,27.99 54.07,27.99 53.76,27.69 53.76,26.42 v54.27,25.91
USB_TX  (via drill 0.41)
  Top 0.254: U$9.P$31 54.87,24.7 v54.88,24.79 | v59.3,30.89 58.07,32.12 U$4.20 | IOL.2 61.89,46.13 63.82,44.2 63.82,35.53 v62.8,34.52
  Bottom 0.254: v62.8,34.52 62.8,34.39 v59.3,30.89 57.01,28.6 53.61,28.6 53.15,28.14 53.15,25.4 53.81,24.79 v54.88,24.79
VBUS  (via drill 0.41, 0.61)
  Top 0.152: U$3.P$4 12.54,45.52 v13.63,46.61
  Top 0.203: D1.A 10.51,48.79 9.96,49.34 R8.2
  Top 0.305: J$1.A4 9.04,45.07 v9.31,45.34 | J$1.A9 9.04,43.07 v9.82,42.29
  Top 0.762: v10.84,47.12 11.35,47.63 D1.A | T1.3 11.25,40.16 v10.96,40.01
  Route15 0.711: J$1.B9 7.71,47.55 | J$1.B4 7.2,41.99 7.79,40.26
  Bottom 0.508: IOH.9 IOH.10
  pour Route15 (isolate 0.152): 23.03,52.58 16.68,52.58 16.68,49.15 6.52,49.02 6.52,39.12 9.69,39.12 9.69,38.99 18.84,38.99 18.84,49.02 23.03,49.02

### Text on the board
tNames: AREF | GND | 13 | 12 | 11 | 10 | 9 | 8 | 7 | 6 | 5 | 4 | 3 | 2 | Tx->1 | RX->0 | USB-C PD 2.0 / Investigation | Colin Szechy | 47uF | rev 1.0 | 100uF | AP2112 | CP2104 | 1N5822 | 22uF | LM2576 | 100uH | 1N5822 | 1000uF | RESET | 3.3V | 5V | GND | GND | VIN | A0 | A1 | A2 | A3 | A4 (SDA) | A5 (SCL)